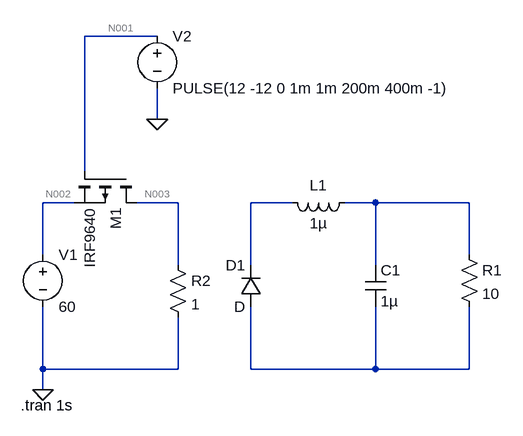
[diagram p0: schematic step-down.asc]
step-down.asc, the LTspice schematic file:
Version 4
SHEET 1 1060 680
WIRE -240 -304 -352 -304
WIRE -240 -176 -240 -224
WIRE -352 -96 -352 -304
WIRE -368 -48 -416 -48
WIRE -208 -48 -272 -48
WIRE -32 -48 -96 -48
WIRE 96 -48 48 -48
WIRE 240 -48 96 -48
WIRE -416 32 -416 -48
WIRE 240 32 240 -48
WIRE -208 48 -208 -48
WIRE -96 48 -96 -48
WIRE 96 48 96 -48
WIRE -416 208 -416 112
WIRE -208 208 -208 128
WIRE -208 208 -416 208
WIRE -96 208 -96 112
WIRE 96 208 96 112
WIRE 96 208 -96 208
WIRE 240 208 240 112
WIRE 240 208 96 208
WIRE -416 240 -416 208
FLAG -416 240 0
FLAG -240 -176 0
SYMBOL voltage -416 16 R0
WINDOW 123 0 0 Left 0
WINDOW 39 0 0 Left 0
SYMATTR InstName V1
SYMATTR Value 60
SYMBOL ind 64 -64 R90
WINDOW 0 5 56 VBottom 2
WINDOW 3 32 56 VTop 2
SYMATTR InstName L1
SYMATTR Value 1µ
SYMBOL cap 80 48 R0
SYMATTR InstName C1
SYMATTR Value 1µ
SYMBOL res 224 16 R0
SYMATTR InstName R1
SYMATTR Value 10
SYMBOL pmos -272 -96 R90
SYMATTR InstName M1
SYMATTR Value IRF9640
SYMBOL diode -80 112 R180
WINDOW 0 24 64 Left 2
WINDOW 3 24 0 Left 2
SYMATTR InstName D1
SYMBOL voltage -240 -320 R0
WINDOW 123 0 0 Left 0
WINDOW 39 0 0 Left 0
SYMATTR InstName V2
SYMATTR Value PULSE(12 -12 0 1m 1m 200m 400m -1)
SYMBOL res -224 32 R0
SYMATTR InstName R2
SYMATTR Value 1
TEXT -450 264 Left 2 !.tran 1s

The netlist it stands for:
* step-down.asc
V1 N002 0 60
L1 N005 N004 1µ
C1 N005 N006 1µ
R1 N005 N006 10
M1 N003 N001 N002 N002 IRF9640
D1 N006 N004 D
V2 N001 0 PULSE(12 -12 0 1m 1m 200m 400m -1)
R2 N003 0 1
.model D D
.lib standard.dio
.model NMOS NMOS
.model PMOS PMOS
.lib standard.mos
.tran 1s
.backanno
.end

* Results of the author's LTspice run, read from the files saved beside the schematic
* Operating Point, zero values left out:
*   V(n002) = 60 V
*   V(n003) = 45.92 V
*   V(n001) = 12 V
*   Id(M1) = -45.92 A
*   Is(M1) = 45.92 A
*   I(R2) = 45.92 A
*   I(V1) = -45.92 A
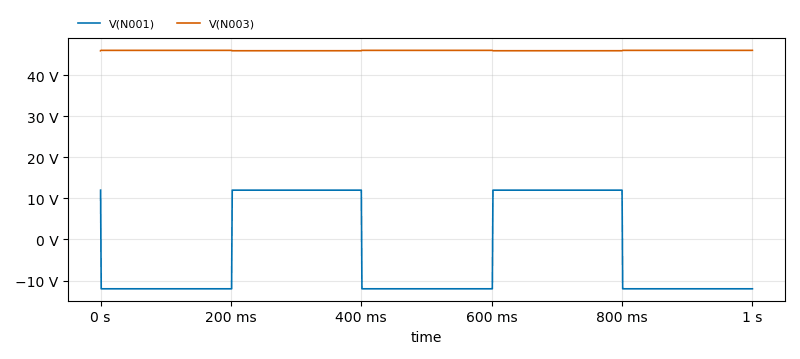
[diagram p1: Transient Analysis of step-down.asc, plotted from the saved traces]
* Transient Analysis, 1 run:
*   V(N001): min -12 V, max 12 V, average -2.436 V, rms 11.99 V, last -12 V
*   V(N003): min 45.92 V, max 46.01 V, average 45.97 V, rms 45.97 V, last 46.01 V